# Altium project MaisPipocaG2.PrjPcb (part 2 of 2)
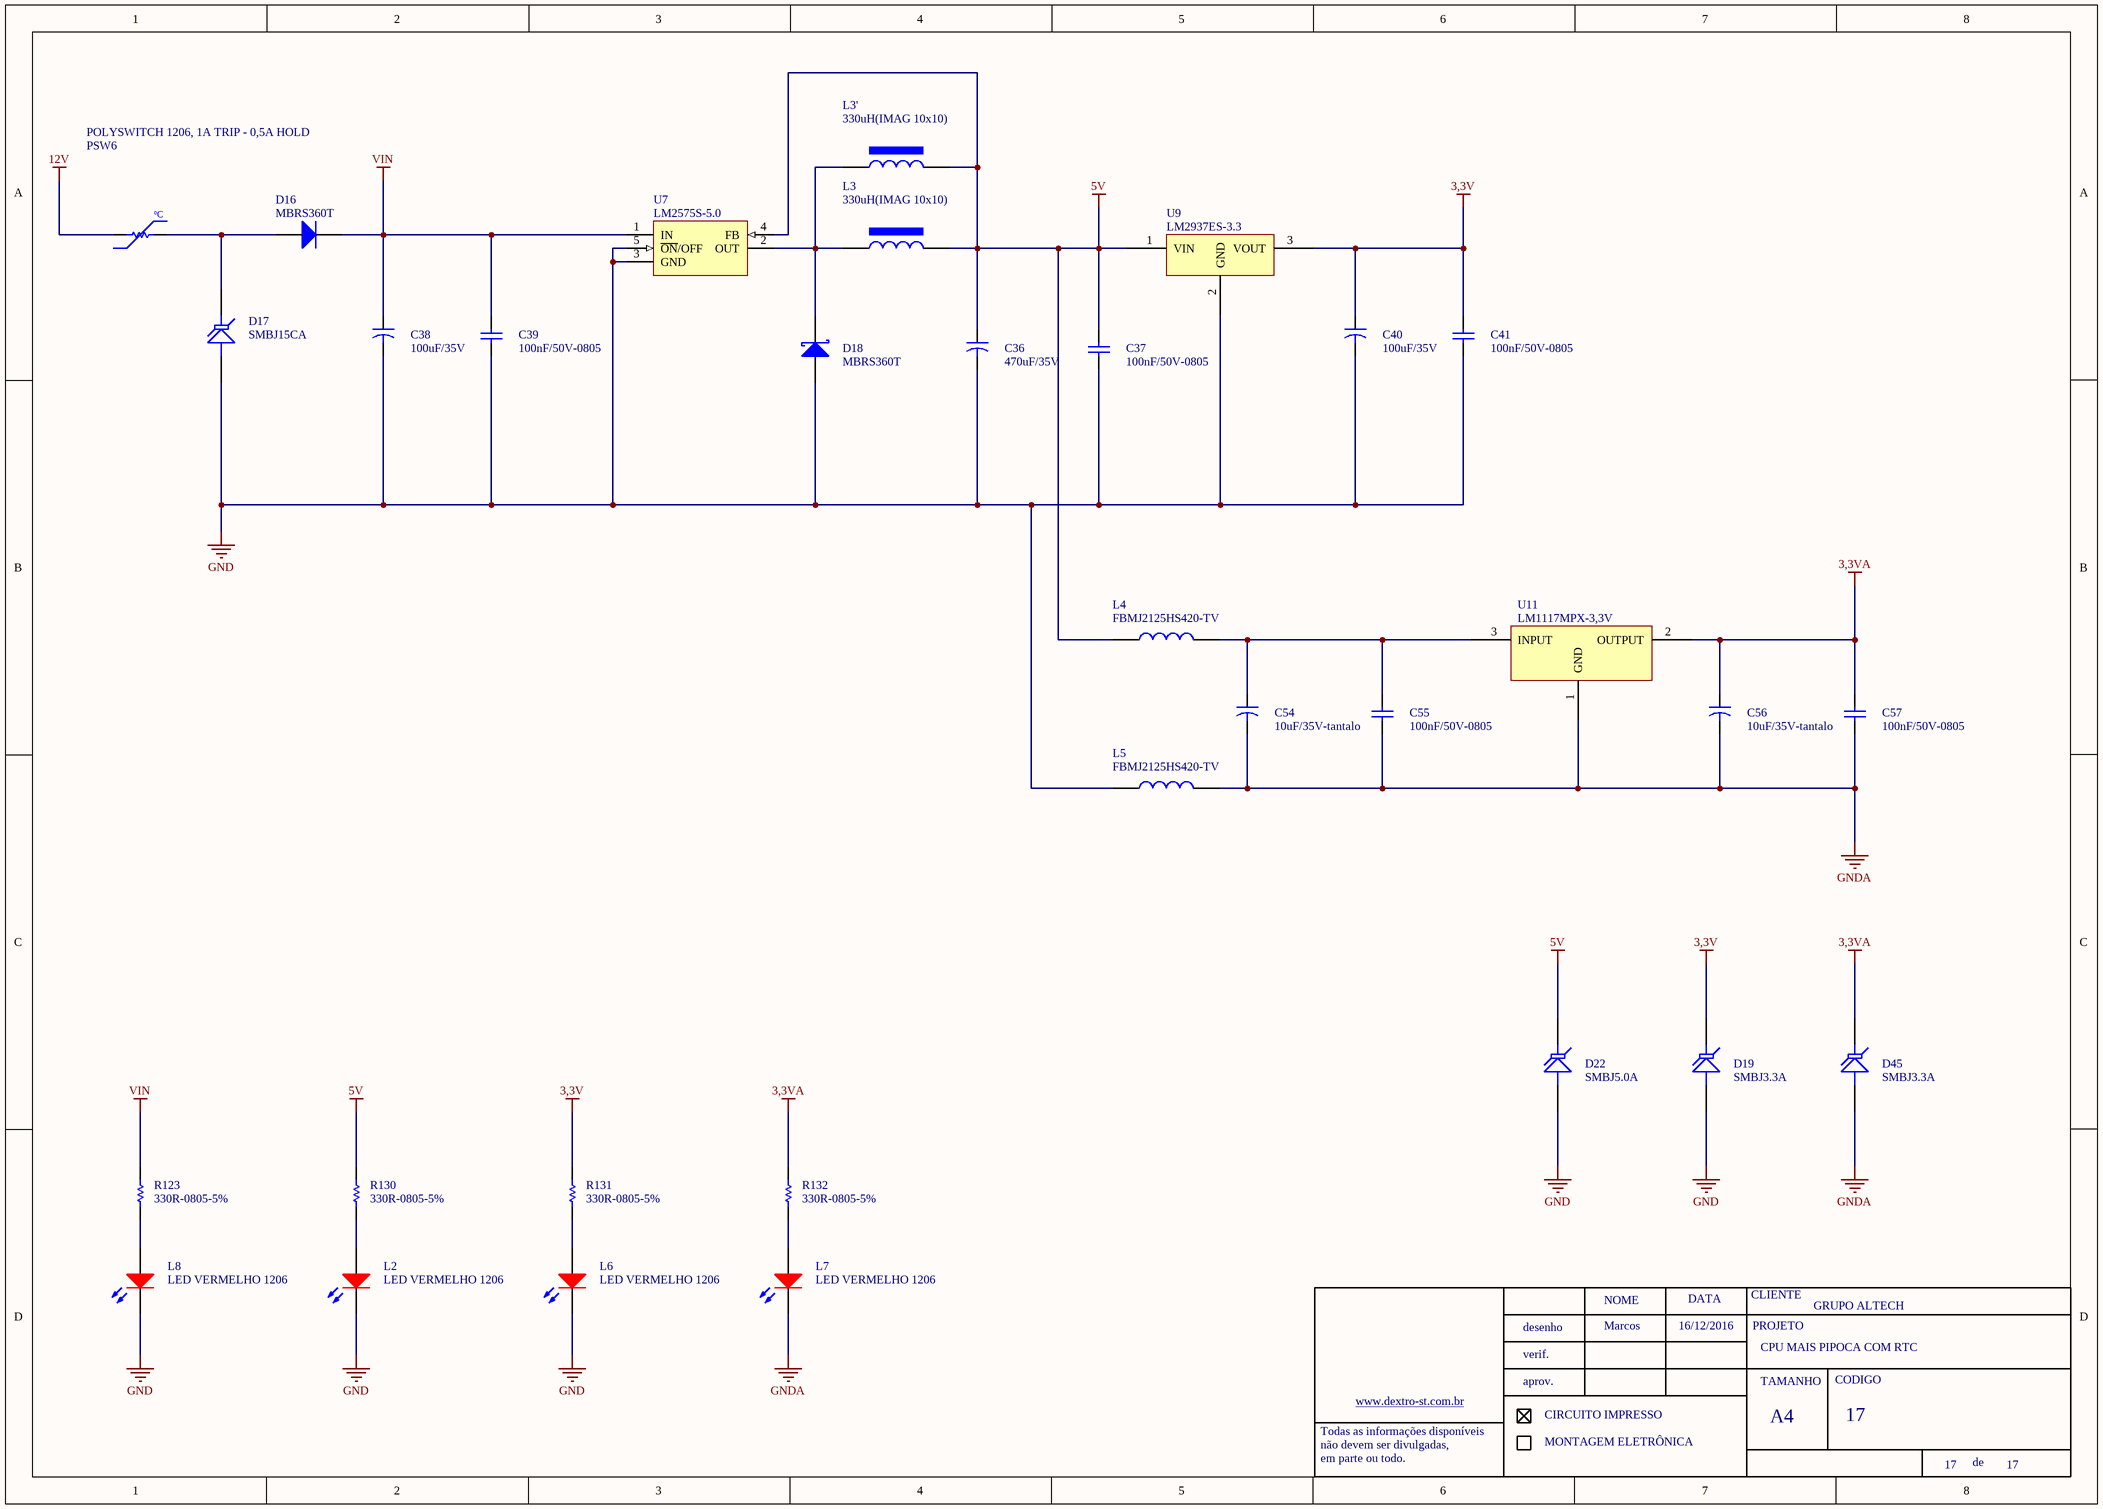
[diagram p17: Regulador.SchDoc]

## Nets that join several sheets
3,3V: Barreira_pacote (D15.2), Controle_Cupula (D2.2 R7.2), Controle_placa_potencia (D4.2 D5.2), ControleEmbalagem (5 pins), ControleLeds (C7.2 U2.10 U2.16), CPU (17 pins), Entrada_comestero_rm5 (12 pins), IHM (R25.1 R26.1 R27.1 R28.1), Interface_gratis (D40.2 R105.2), InterfaceConfiguracao (C27.2 C51.2 U6.16 U10.16), JTAG (10 pins), Meios_pagamento (D13.2 D14.2 R40.2 R41.2), Memoria (16 pins), Porta_MDB (D35.2), Regulador (5 pins)
3,3VA: Controle_placa_potencia (D7.2 R16.2), CPU (U4.10 U4.12), Regulador (5 pins)
5V: amplificadorAudio (R80.1), Barreira_pacote (R57.2 R58.2), ControleEmbalagem (J4.4), IHM (7 pins), InterfaceConfiguracao (C72.2 U13.4 U13.20), Porta_MDB (Q13.3 R93.1 R95.2), Regulador (9 pins)
12V: amplificadorAudio (6 pins), Barreira_pacote (J11.1), Controle_Cupula (PSW1.2), Controle_placa_potencia (J3.1), ControleEmbalagem (J4.1), ControleLeds (J5.1 J6.1 J20.1), Entrada_comestero_rm5 (J13.2 Q11.2 R67.1), Interface_gratis (J18.1), JTAG (J16.1), Meios_pagamento (J8.1 J9.1), Porta_MDB (J22.1), Regulador (PSW6.1)
GND: amplificadorAudio (30 pins), Barreira_pacote (5 pins), Controle_Cupula (13 pins), Controle_placa_potencia (5 pins), ControleEmbalagem (10 pins), ControleLeds (10 pins), CPU (20 pins), Entrada_comestero_rm5 (15 pins), IHM (13 pins), Interface_gratis (5 pins), InterfaceConfiguracao (27 pins), JTAG (18 pins), Meios_pagamento (10 pins), Memoria (13 pins), Porta_MDB (9 pins), Regulador (17 pins)
GNDA: Controle_placa_potencia (C11.1 D7.1 R18.1), CPU (U4.11 U4.15), Regulador (8 pins)
AUDIO: amplificadorAudio (R1.1), CPU (U4.6)
BOTAO_GRATIS: CPU (U4.27), Interface_gratis (D40.3 R106.2)
DEC: CPU (U4.90), IHM (R27.2 S3.2)
ENTER: CPU (U4.89), IHM (R28.2 S4.2)
ESC: CPU (U4.92), IHM (R25.2 S1.2)
FIM_DO_PAPEL: ControleEmbalagem (C12.2 D8.3 R19.2), CPU (U4.8)
FLASH_CE_1: CPU (U4.63), Memoria (U8.1)
FLASH_CE_2: CPU (U4.57), Memoria (U14.4)
FLASH_SCK: CPU (U4.62), Memoria (U8.6 U14.2)
FLASH_SI: CPU (U4.60), Memoria (U8.5 U14.1)
FLASH_SO: CPU (U4.61), Memoria (U8.2 U14.8)
H_DIR_EMB: Controle_Cupula (R112.1), CPU (U4.21)
H_ES_EMB: Controle_Cupula (R111.1), CPU (U4.44)
INC: CPU (U4.91), IHM (R26.2 S2.2)
INHIBIT_P70: CPU (U4.39), Meios_pagamento (R54.2)
INHIBIT_UCA1: CPU (U4.38), Meios_pagamento (R53.2)
L_DIR_EMB: Controle_Cupula (R116.1), CPU (U4.20)
L_ES_EMB: Controle_Cupula (R115.1), CPU (U4.45)
LCD2_D4: CPU (U4.67), IHM (U5.4)
LCD2_D5: CPU (U4.66), IHM (U5.5)
LCD2_D6: CPU (U4.65), IHM (U5.6)
LCD2_D7: CPU (U4.64), IHM (U5.7)
LCD2_ENABLE: CPU (U4.69), IHM (U5.3)
LCD2_RS: CPU (U4.68), IHM (U5.2)
LCD_D4: CPU (U4.93), IHM (R34.2)
LCD_D5: CPU (U4.94), IHM (R32.2)
LCD_D6: CPU (U4.80), IHM (R31.2)
LCD_D7: CPU (U4.81), IHM (R30.2)
LCD_ENABLE: CPU (U4.86), IHM (LCD1.6)
LCD_RS: CPU (U4.7), IHM (LCD1.4)
LED_GRATIS: CPU (U4.26), Interface_gratis (R107.1)
LEDS_CLOCK: ControleLeds (U2.11), CPU (U4.36)
LEDS_DATA: ControleLeds (U2.14), CPU (U4.34)
LEDS_STROBE: ControleLeds (U2.12), CPU (U4.35)
LIGA_NEUTRO_POT: Controle_placa_potencia (R14.1), CPU (U4.33)
MOTOR_EMBALAGEM: ControleEmbalagem (R24.2), IHM (U5.12)
P_FITA_LED_DIR: ControleLeds (R38.1), CPU (U4.85)
P_FITA_LED_ESQ: ControleLeds (R36.1), CPU (U4.82)
PULSO_CONT_MOTOR: Controle_placa_potencia (R13.1), CPU (U4.70)
PULSO_CONT_RES: Controle_placa_potencia (R12.2), CPU (U4.73)
PULSO_MOEDE_UCA1: CPU (U4.51), Meios_pagamento (C32.2 D13.3 R42.1)
PULSO_NOTEI_P70: CPU (U4.50), Meios_pagamento (C33.2 D14.3 R43.2)
REED_DOSADOR: Controle_Cupula (D2.3 R8.2), CPU (U4.88)
RESET: CPU (U4.17), JTAG (5 pins)
RM5_CH1: CPU (U4.59), Entrada_comestero_rm5 (D24.3 R74.2)
RM5_CH2: CPU (U4.58), Entrada_comestero_rm5 (D28.3 R79.2)
RM5_CH3: CPU (U4.25), Entrada_comestero_rm5 (D32.3 R91.2)
RM5_CH4: CPU (U4.24), Entrada_comestero_rm5 (D26.3 R75.2)
RM5_CH5: CPU (U4.29), Entrada_comestero_rm5 (D30.3 R84.2)
RM5_CH6: CPU (U4.30), Entrada_comestero_rm5 (D34.3 R92.2)
RM5_INHIBIT: CPU (U4.40), Entrada_comestero_rm5 (R70.2)
RTCK: CPU (U4.100), JTAG (J12.11 J14.2)
RXD_MDB: CPU (U4.49), Porta_MDB (C49.2 D35.3 R101.2)
RXD_MOEDEIRO: Barreira_pacote (D15.3 R59.2), CPU (U4.99)
RXD_PROG: CPU (R64.1 U4.47), InterfaceConfiguracao (U10.3)
SAIDA_01: CPU (U4.95), IHM (U5.8)
SAIDA_PAPEL: ControleEmbalagem (D11.3 R23.2), CPU (U4.37)
SD_CS: CPU (U4.79), Memoria (D48.3 J17.2 R4.2)
SD_MISO: CPU (U4.77), Memoria (D38.3 J17.7)
SD_MOSI: CPU (U4.76), Memoria (D47.3 J17.3 R5.2)
SD_SCLK: CPU (U4.78), Memoria (D46.3 J17.5 R6.2)
SEL_PROG_DEX_A: CPU (U4.43), InterfaceConfiguracao (U10.10)
SEL_PROG_DEX_B: CPU (U4.56), InterfaceConfiguracao (U10.9)
SINAL_RPM: Controle_placa_potencia (C10.1 D5.3 R15.2), CPU (U4.32)
SINCRONISMO_60HZ: Controle_placa_potencia (C9.1 D4.3 R11.2), CPU (U4.52)
TCK: CPU (U4.5), JTAG (J12.9 R51.1)
TDI: CPU (U4.2), JTAG (J12.5 R46.2)
TDO: CPU (U4.1), JTAG (J12.13 R44.2)
TELET_RXD: CPU (U4.74), JTAG (D37.3 R102.2)
TELET_TXD: CPU (U4.75), JTAG (D36.3 R97.2)
TEMPERATURA: Controle_placa_potencia (C11.2 D7.3 R17.2), CPU (U4.9)
TMS: CPU (U4.3), JTAG (J12.7 R45.2)
TRSTN: CPU (U4.4), JTAG (J12.3 R47.2)
TXD_MDB: CPU (U4.48), Porta_MDB (R98.2)
TXD_MOEDEIRO: Barreira_pacote (R60.2), CPU (U4.98)
TXD_PROG: CPU (R63.1 U4.46), InterfaceConfiguracao (U10.13)